# EAGLE schematic SolarHarvesterSchematic (EAGLE 9.6.2)
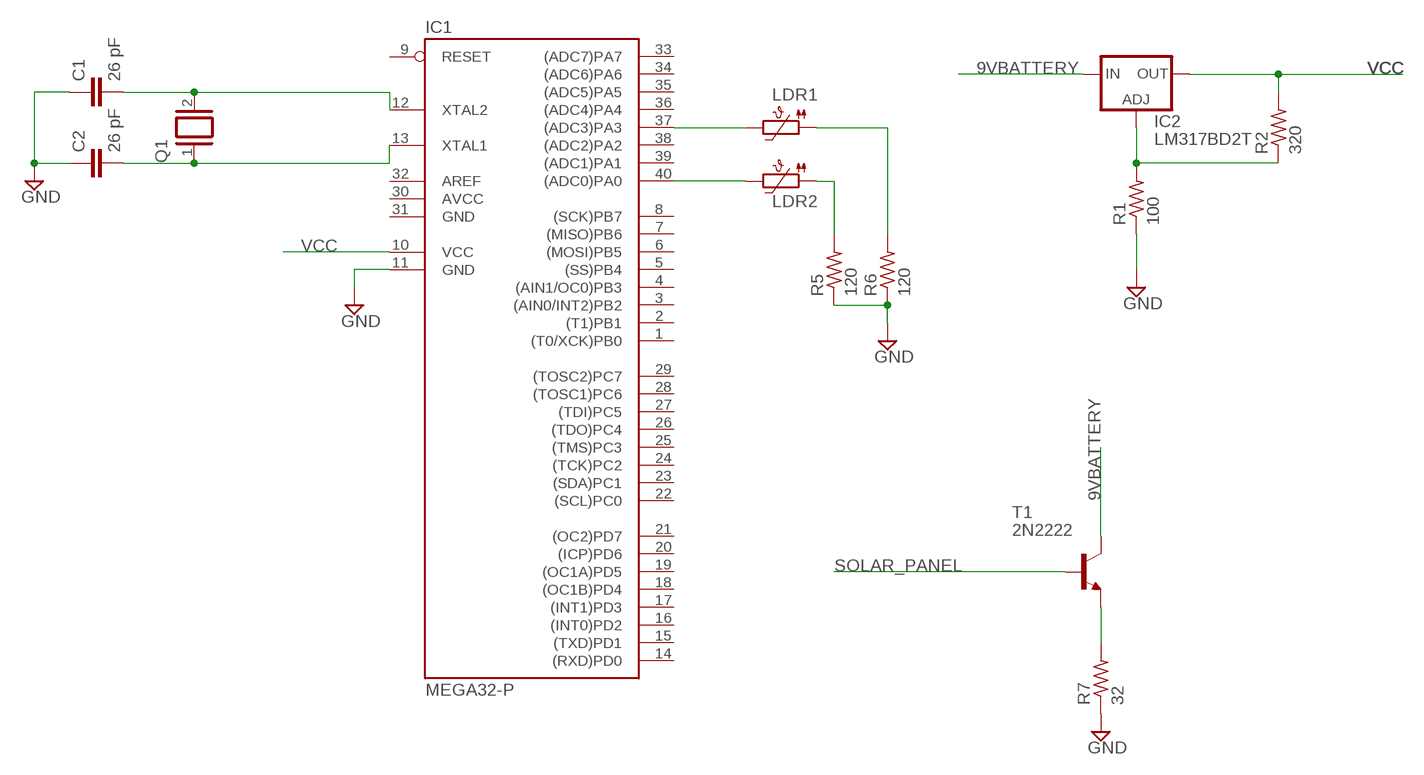
[diagram p0: schematic, sheet 1]

## Parts
C1  26 pF  C-EU025-024X044  [C025-024X044]
C2  26 pF  C-EU025-024X044  [C025-024X044]
IC1  MEGA32-P  [DIL40]
IC2  LM317BD2T  [D2PACK]
LDR1  PTC-SOD70  [SOD70]
LDR2  PTC-SOD70  [SOD70]
Q1  XTAL  [Q]
R1  100  R-US_0204/2V  [0204V]
R2  320  R-US_0204/2V  [0204V]
R5  120  R-US_0204/2V  [0204V]
R6  120  R-US_0204/2V  [0204V]
R7  32  R-US_0204/2V  [0204V]
T1  2N2222  [TO18]

## Nets
9VBATTERY: IC2.3(IN) T1.3(C)
GND: C1.1 C2.1 IC1.11(GND) R1.1 R5.1 R6.1 R7.1
N$1: C1.2 IC1.12(XTAL2) Q1.2
N$2: C2.2 IC1.13(XTAL1) Q1.1
N$3: IC1.37((ADC3)PA3) LDR1.2
N$4: IC2.1(ADJ) R1.2 R2.1
N$5: LDR1.1 R6.2
N$6: IC1.40((ADC0)PA0) LDR2.2
N$7: LDR2.1 R5.2
N$8: R7.2 T1.1(E)
SOLAR_PANEL: T1.2(B)
VCC: IC1.10(VCC) IC2.2(OUT) R2.2
Unconnected: IC1.1((T0/XCK)PB0) IC1.2((T1)PB1) IC1.3((AIN0/INT2)PB2) IC1.4((AIN1/OC0)PB3) IC1.5((SS)PB4) IC1.6((MOSI)PB5) IC1.7((MISO)PB6) IC1.8((SCK)PB7) IC1.9(RESET) IC1.14((RXD)PD0) IC1.15((TXD)PD1) IC1.16((INT0)PD2) IC1.17((INT1)PD3) IC1.18((OC1B)PD4) IC1.19((OC1A)PD5) IC1.20((ICP)PD6) IC1.21((OC2)PD7) IC1.22((SCL)PC0) IC1.23((SDA)PC1) IC1.24((TCK)PC2) IC1.25((TMS)PC3) IC1.26((TDO)PC4) IC1.27((TDI)PC5) IC1.28((TOSC1)PC6) IC1.29((TOSC2)PC7) IC1.32(AREF) IC1.33((ADC7)PA7) IC1.34((ADC6)PA6) IC1.35((ADC5)PA5) IC1.36((ADC4)PA4) IC1.38((ADC2)PA2) IC1.39((ADC1)PA1)

## Power pins joined to a net without a drawn wire
AVCC: IC1.30(AVCC)
GND: IC1.31(GND)

## Library data of the parts
C1 C2 = rcl:C-EU: CAPACITOR, European symbol; SPICEPREFIX: C
IC1 = atmel:MEGA32-P: MICROCONTROLLER 32 Kbytes FLASH 2 Kbytes SRAM 1 Kbytes EEPROM USART 8-channel 10 bit ADC Source: www.atmel.com .. doc2503.pdf; MPN: ATMEGA32-16PU; OC_FARNELL: 1661729; OC_NEWARK: 51P1794
IC2 = v-reg:LM317?*: 500 mA Adjustable Output Positive Voltage Regulator Source: http://www.onsemi.co.jp .. LM317M-D.PDF
LDR1 LDR2 = ptc-ntc:PTC-: Positive Temperature Coefficient Resistor (PTC) termistor Philips KTY81-210 - KTY81-252 Source: 153627-da-01-en-Temperatur-Sensor_KTY10-6_Philips.pdf; OC_FARNELL: unknown; OC_NEWARK: unknown
Q1 = special:XTAL: CRYSTAL
R1 R2 R5-R7 = rcl:R-US_: RESISTOR, American symbol; SPICEPREFIX: R
T1 = transistor:2N2222: NPN TRANSISTOR